# Altium schematic sheet pripherals2.SchDoc
size A4
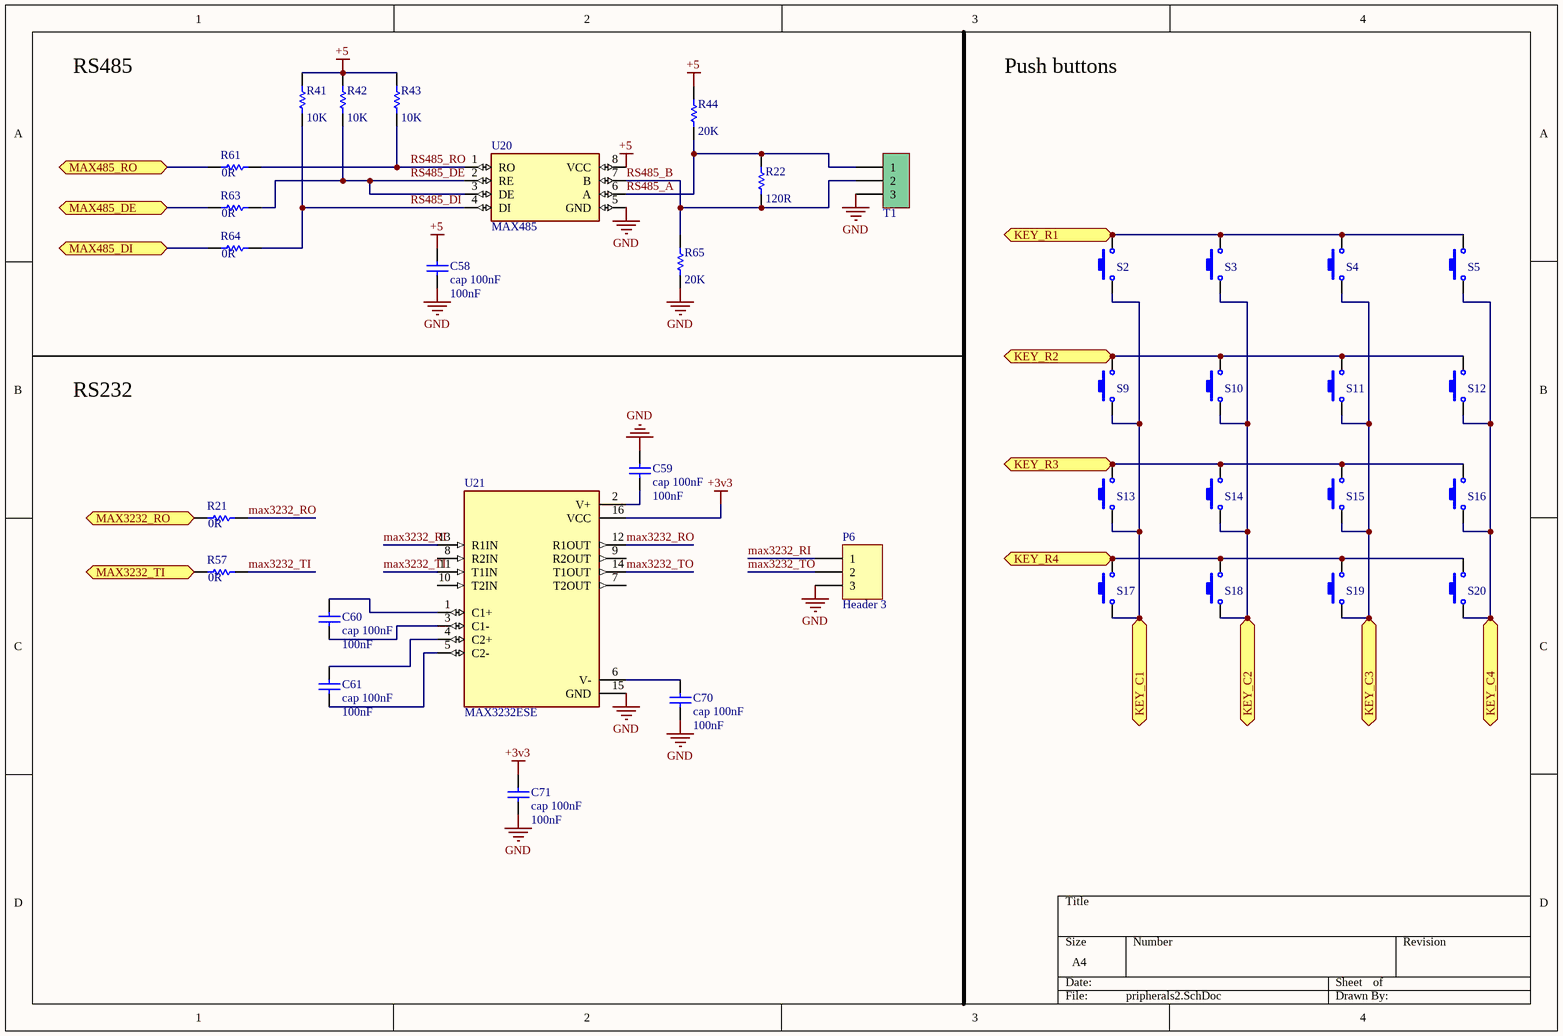
[diagram p0: pripherals2.SchDoc]

## Parts
C58  cap 100nF  value 100nF  [Cap 805]
C59  cap 100nF  value 100nF  [Cap 805]
C60  cap 100nF  value 100nF  [Cap 805]
C61  cap 100nF  value 100nF  [Cap 805]
C70  cap 100nF  value 100nF  [Cap 805]
C71  cap 100nF  value 100nF  [Cap 805]
P6  Header 3  [HDR1X3]
R21  value 0R  [RES 0805 (2012X06L)]  (hidden comment: Res 0R)
R22  value 120R  [RES 0805 (2012X06L)]  (hidden comment: Res 120R)
R41  value 10K  [RES 0805 (2012X06L)]  (hidden comment: Res 10K)
R42  value 10K  [RES 0805 (2012X06L)]  (hidden comment: Res 10K)
R43  value 10K  [RES 0805 (2012X06L)]  (hidden comment: Res 10K)
R44  value 20K  [RES 0805 (2012X06L)]  (hidden comment: Res 20K)
R57  value 0R  [RES 0805 (2012X06L)]  (hidden comment: Res 0R)
R61  value 0R  [RES 0805 (2012X06L)]  (hidden comment: Res 0R)
R63  value 0R  [RES 0805 (2012X06L)]  (hidden comment: Res 0R)
R64  value 0R  [RES 0805 (2012X06L)]  (hidden comment: Res 0R)
R65  value 20K  [RES 0805 (2012X06L)]  (hidden comment: Res 20K)
S2  Switch PB 12*12mm  [tact-12mm]  (value not drawn)
S3  Switch PB 12*12mm  [tact-12mm]  (value not drawn)
S4  Switch PB 12*12mm  [tact-12mm]  (value not drawn)
S5  Switch PB 12*12mm  [tact-12mm]  (value not drawn)
S9  Switch PB 12*12mm  [tact-12mm]  (value not drawn)
S10  Switch PB 12*12mm  [tact-12mm]  (value not drawn)
S11  Switch PB 12*12mm  [tact-12mm]  (value not drawn)
S12  Switch PB 12*12mm  [tact-12mm]  (value not drawn)
S13  Switch PB 12*12mm  [tact-12mm]  (value not drawn)
S14  Switch PB 12*12mm  [tact-12mm]  (value not drawn)
S15  Switch PB 12*12mm  [tact-12mm]  (value not drawn)
S16  Switch PB 12*12mm  [tact-12mm]  (value not drawn)
S17  Switch PB 12*12mm  [tact-12mm]  (value not drawn)
S18  Switch PB 12*12mm  [tact-12mm]  (value not drawn)
S19  Switch PB 12*12mm  [tact-12mm]  (value not drawn)
S20  Switch PB 12*12mm  [tact-12mm]  (value not drawn)
T1  Phoenix terminal 3  [phoenix terminal 3]  (value not drawn)
U20  MAX485  [SOIC8-Narrow]
U21  MAX3232ESE  [SOIC16_M]

## Ports
KEY_C1 (bidir), KEY_C2 (bidir), KEY_C3 (bidir), KEY_C4 (bidir), KEY_R1 (bidir), KEY_R2 (bidir), KEY_R3 (bidir), KEY_R4 (bidir), MAX485_DE (bidir), MAX485_DI (bidir), MAX485_RO (bidir), MAX3232_RO (bidir), MAX3232_TI (bidir)

## Nets
+3v3: C71.1 U21.16(VCC)
+5: C58.1 R41.1 R42.1 R43.1 R44.1 U20.8(VCC)
GND: C58.2 C59.1 C70.2 C71.2 P6.3 R65.2 T1.3 U20.5(GND) U21.15(GND)
KEY_C1: S2.1 S9.1 S13.1 S17.1 ; port KEY_C1
KEY_C2: S3.1 S10.1 S14.1 S18.1 ; port KEY_C2
KEY_C3: S4.1 S11.1 S15.1 S19.1 ; port KEY_C3
KEY_C4: S5.1 S12.1 S16.1 S20.1 ; port KEY_C4
KEY_R1: S2.2 S3.2 S4.2 S5.2 ; port KEY_R1
KEY_R2: S9.2 S10.2 S11.2 S12.2 ; port KEY_R2
KEY_R3: S13.2 S14.2 S15.2 S16.2 ; port KEY_R3
KEY_R4: S17.2 S18.2 S19.2 S20.2 ; port KEY_R4
MAX485_DE: R63.1 ; port MAX485_DE
MAX485_DI: R64.1 ; port MAX485_DI
MAX485_RO: R61.1 ; port MAX485_RO
max3232_RI: P6.1 U21.13(R1IN)
max3232_RO: R21.2 U21.12(R1OUT)
MAX3232_RO: R21.1 ; port MAX3232_RO  [a separate net that carries the same name]
max3232_TI: R57.2 U21.11(T1IN)
MAX3232_TI: R57.1 ; port MAX3232_TI  [a separate net that carries the same name]
max3232_TO: P6.2 U21.14(T1OUT)
RS485_A: R22.1 R44.2 T1.1 U20.6(A)
RS485_B: R22.2 R65.1 T1.2 U20.7(B)
RS485_DE: R42.2 R63.2 U20.2(RE) U20.3(DE)
RS485_DI: R41.2 R64.2 U20.4(DI)
RS485_RO: R43.2 R61.2 U20.1(RO)
NetC59_2: C59.2 U21.2(V+)
NetC60_1: C60.1 U21.1(C1+)
NetC60_2: C60.2 U21.3(C1-)
NetC61_1: C61.1 U21.4(C2+)
NetC61_2: C61.2 U21.5(C2-)
NetC70_1: C70.1 U21.6(V-)

Not connected (* = marked no-connect by the designer): U21 7(T2OUT) 8(R2IN) 9(R2OUT) 10(T2IN)

## Notes on the sheet
- RS485
- Push buttons
- RS232

## Library data of the parts
C58-C61 C70 C71 = Cap: Capacitor; Published: 8-Jun-2000; LatestRevisionDate: 17-Jul-2002; LatestRevisionNote: Re-released for DXP Platform.; PackageReference: RAD-0.3; Publisher: Altium Limited; PackageDescription: Radial Cap, Thru-Hole; 2 Leads; 0.3 in Pin Spacing
P6 = Header 3: Header, 3-Pin; LatestRevisionDate: 17-Jul-2002; LatestRevisionNote: Re-released for DXP Platform.; Publisher: Altium Limited
R21 R22 R41-R44 R57 R61 R63-R65 = Res1: Resistor; Published: 8-Jun-2000; LatestRevisionDate: 17-Jul-2002; LatestRevisionNote: Re-released for DXP Platform.; PackageReference: AXIAL-0.3; Publisher: Altium Limited; PackageDescription: Axial Device, Thru-Hole; 2 Leads; 0.3 in Pin Spacing
S2-S5 S9-S20 = Switch PB: Push Button Switch
T1 = Phoenix terminal 3: Terminal 3 Pin; Designer: Seyed Mohsen Ghasemain; E-mail: picpars@gmail.com; ComponentLinkURL: www.picpars.com
U20 = MAX485: 1/1 Transceiver Half RS422, RS485 8-SOIC; MF: Maxim Integrated; SnapEDA_Link: https://www.snapeda.com/parts/MAX485/Maxim%20Integrated/view-part/493689/?ref=snap; Package: SOIC-8 Maxim Integrated; MP: MAX485; Value: *; Digi-Key_Part_Number: MAX485CSA+TCT-ND; Digi-Key_Purchase_URL: https://www.digikey.com/product-detail/en/maxim-integrated/MAX485CSA-T/MAX485CSA-TCT-ND/3894816?utm_source=snapeda&utm_medium=aggregator&utm_campaign=symbol
U21 = MAX3232ESE: 2/2 Transceiver Full RS232 16-SO; MF: Maxim Integrated; MP: MAX3232ESE; SnapEDA_Link: https://www.snapeda.com/parts/MAX3232ESE/Maxim%20Integrated/view-part/991442/?ref=snap; Price: None; Package: None; Availability: Unavailable; Value: *